# Altium schematic sheet 0016_Processor - PM , C.SchDoc
size 848 x 558 mm
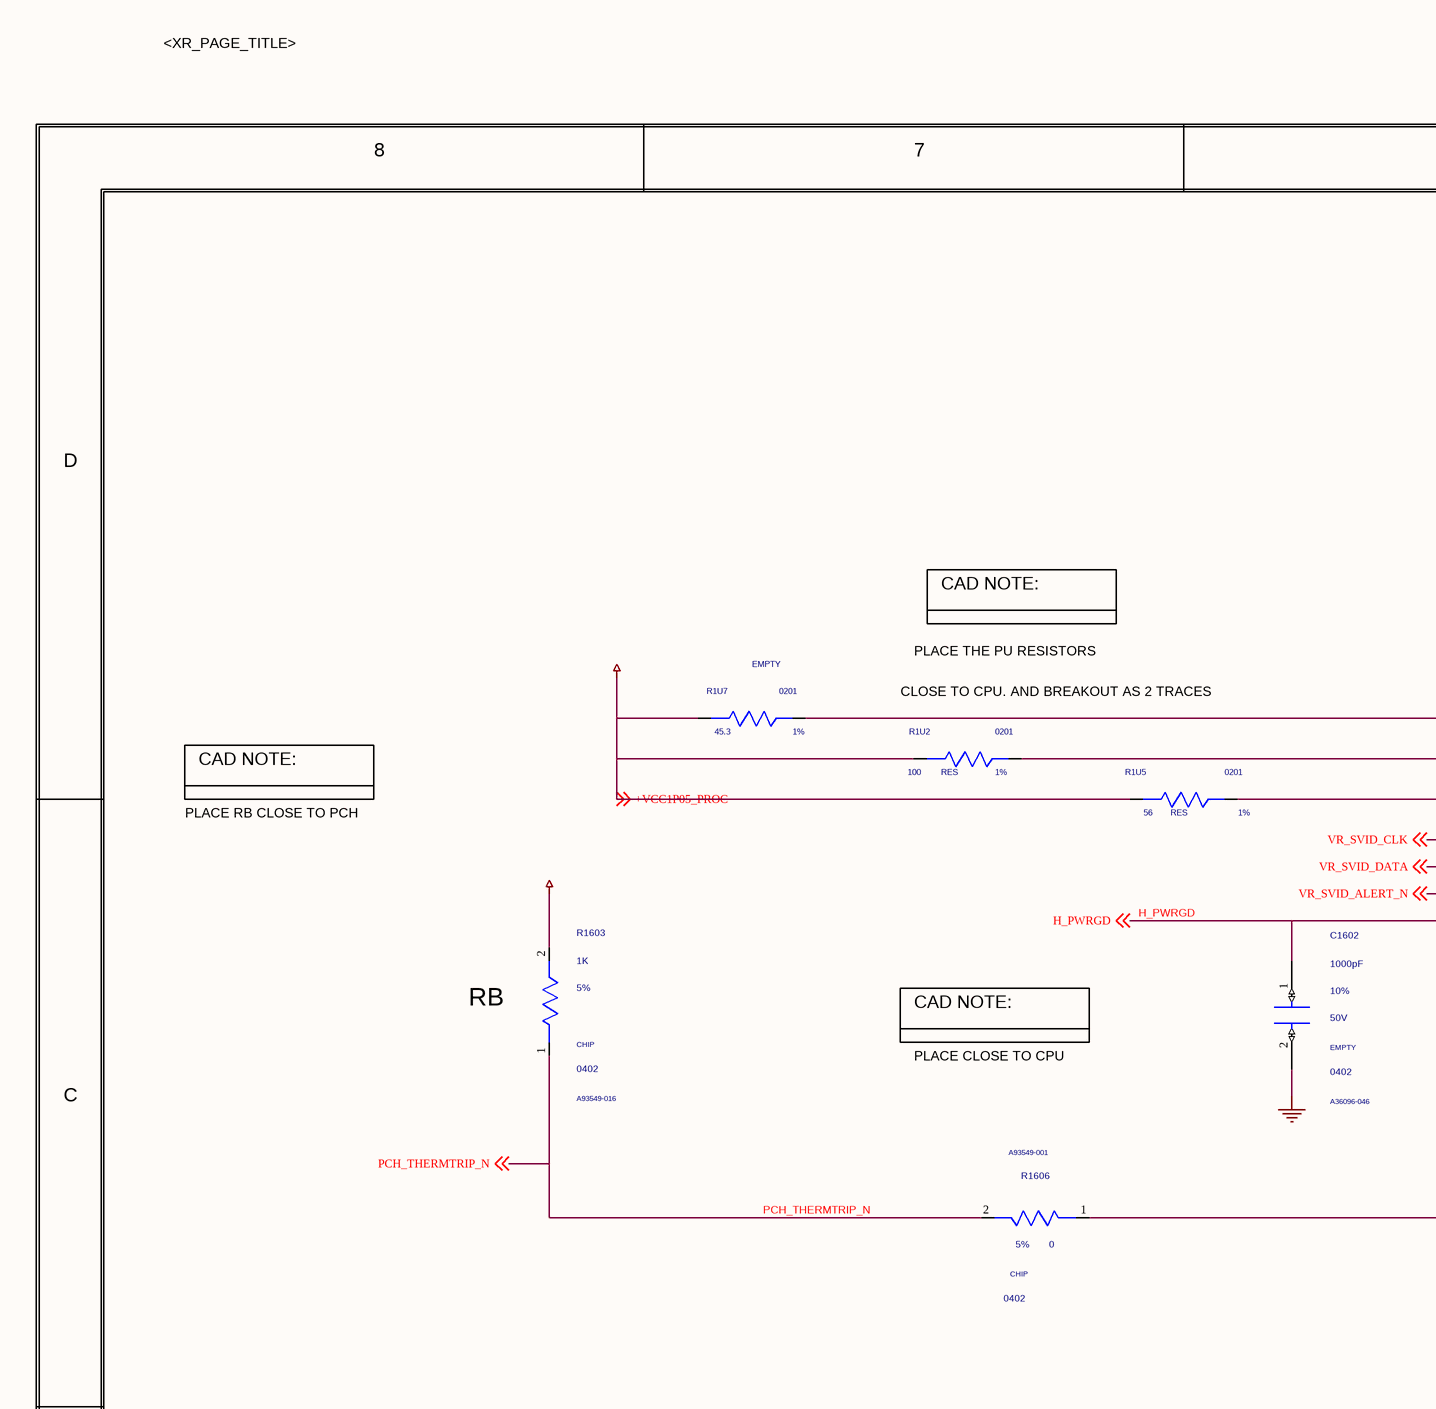
[diagram p0: 0016_Processor - PM , C.SchDoc, top left]
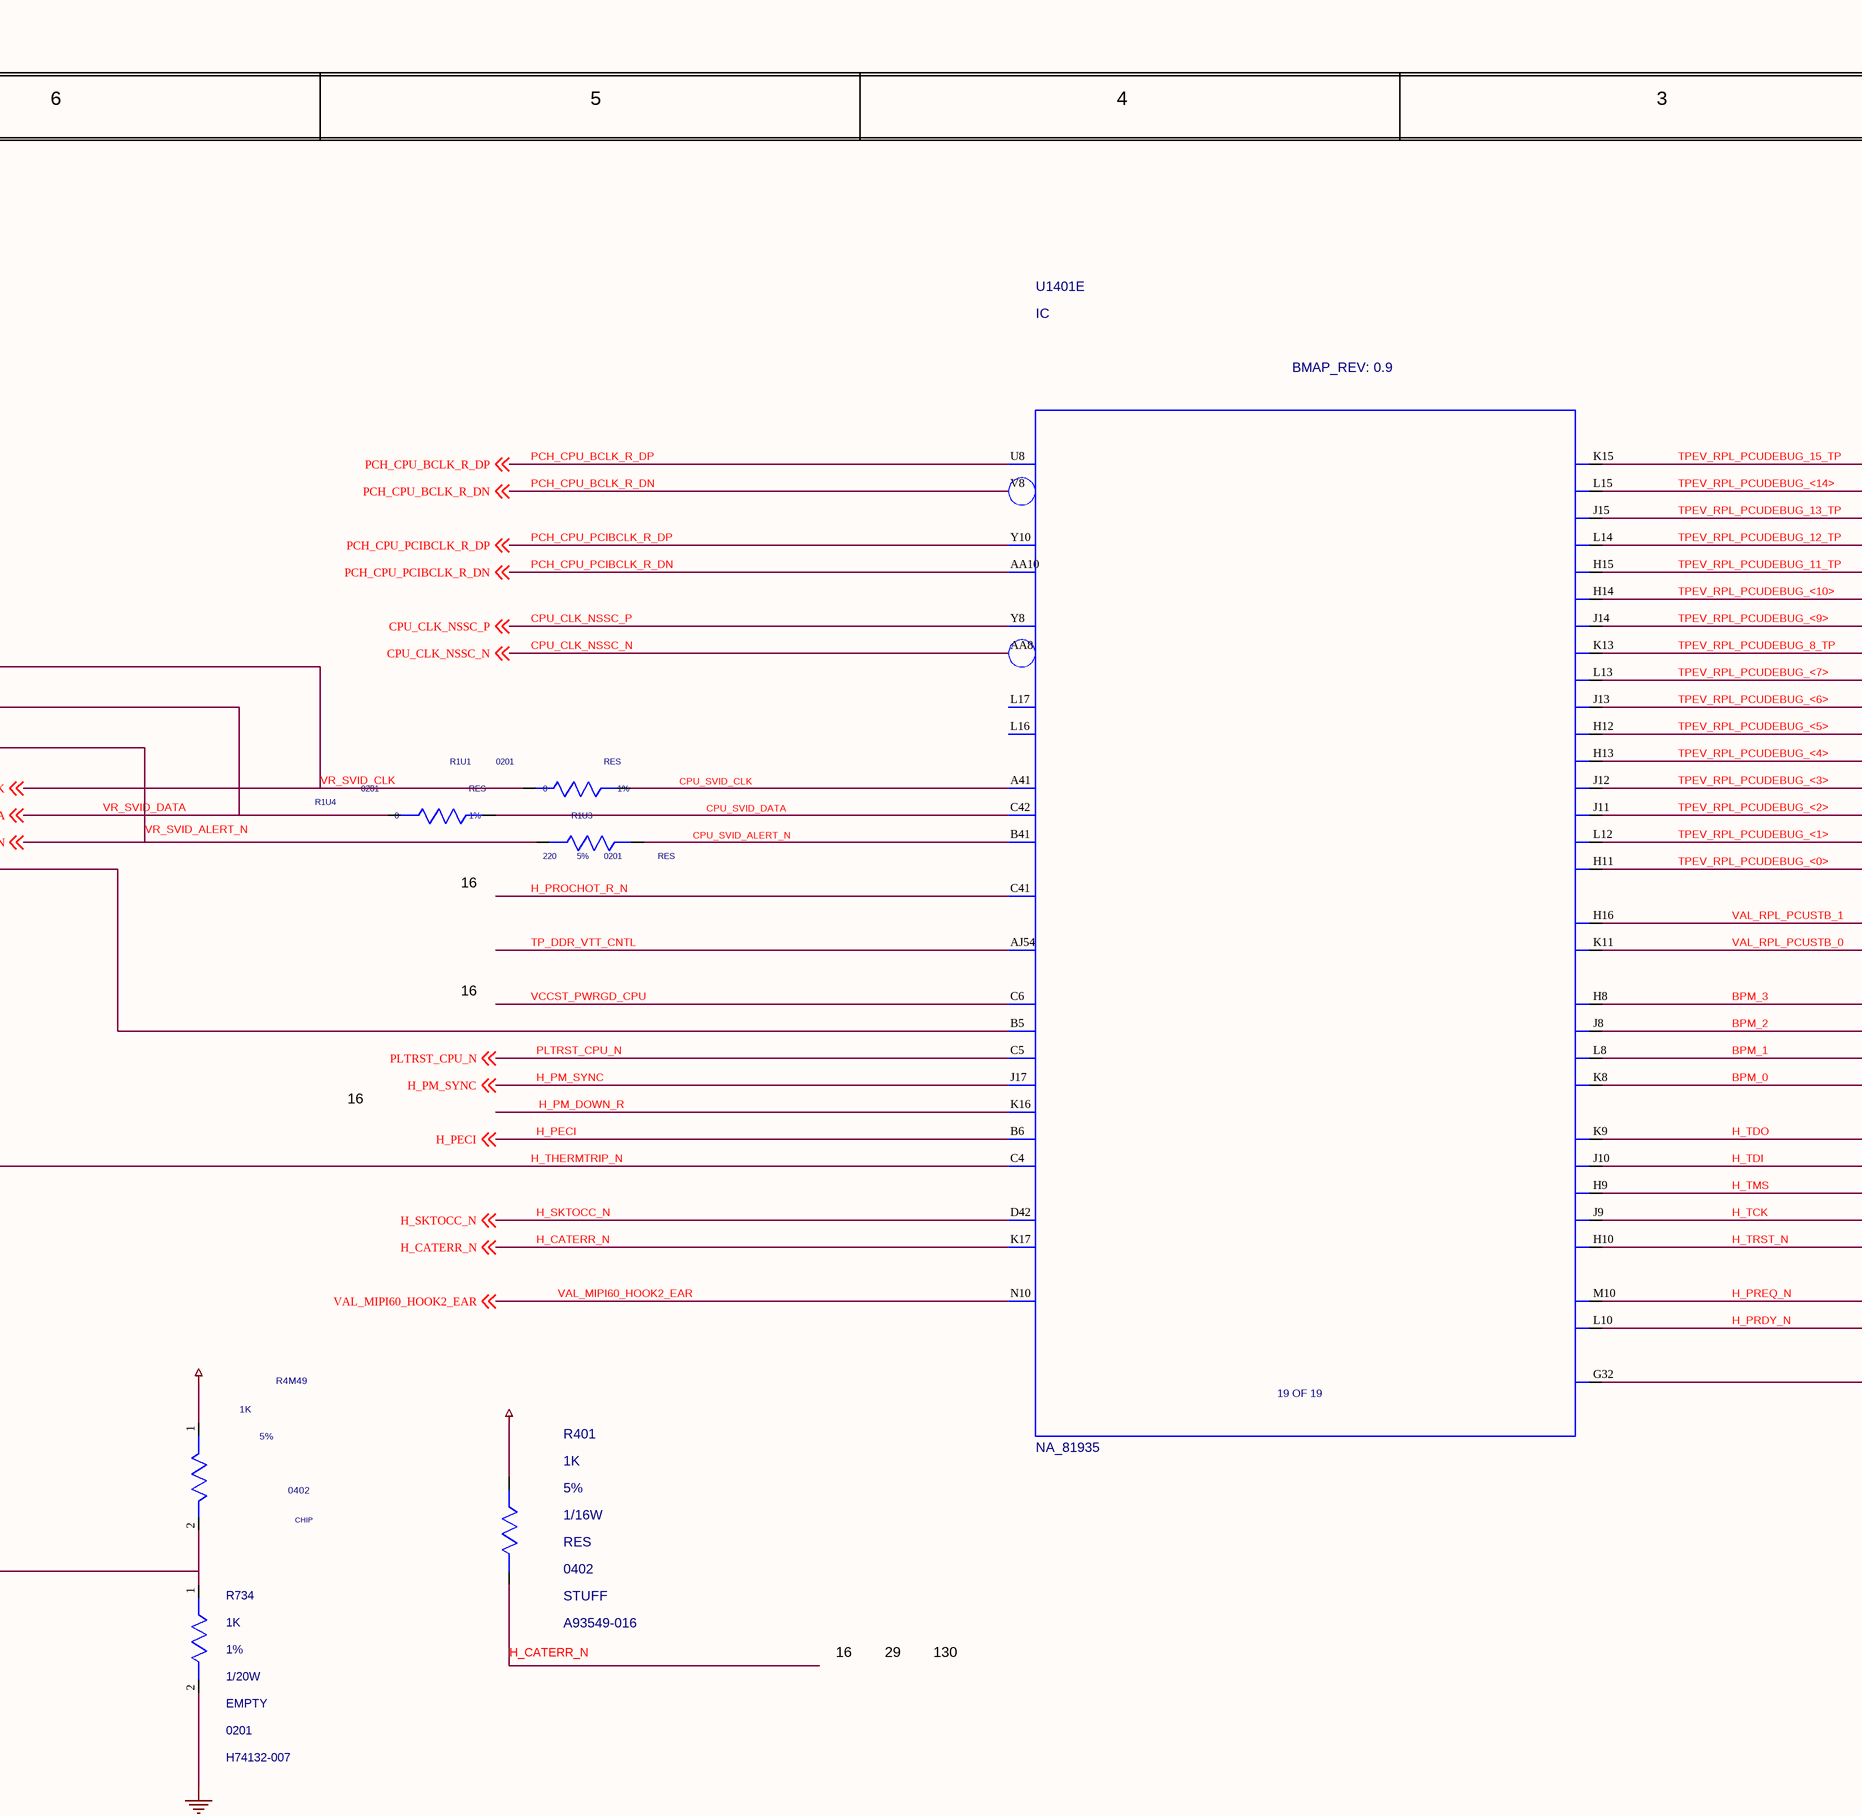
[diagram p1: 0016_Processor - PM , C.SchDoc, top middle]
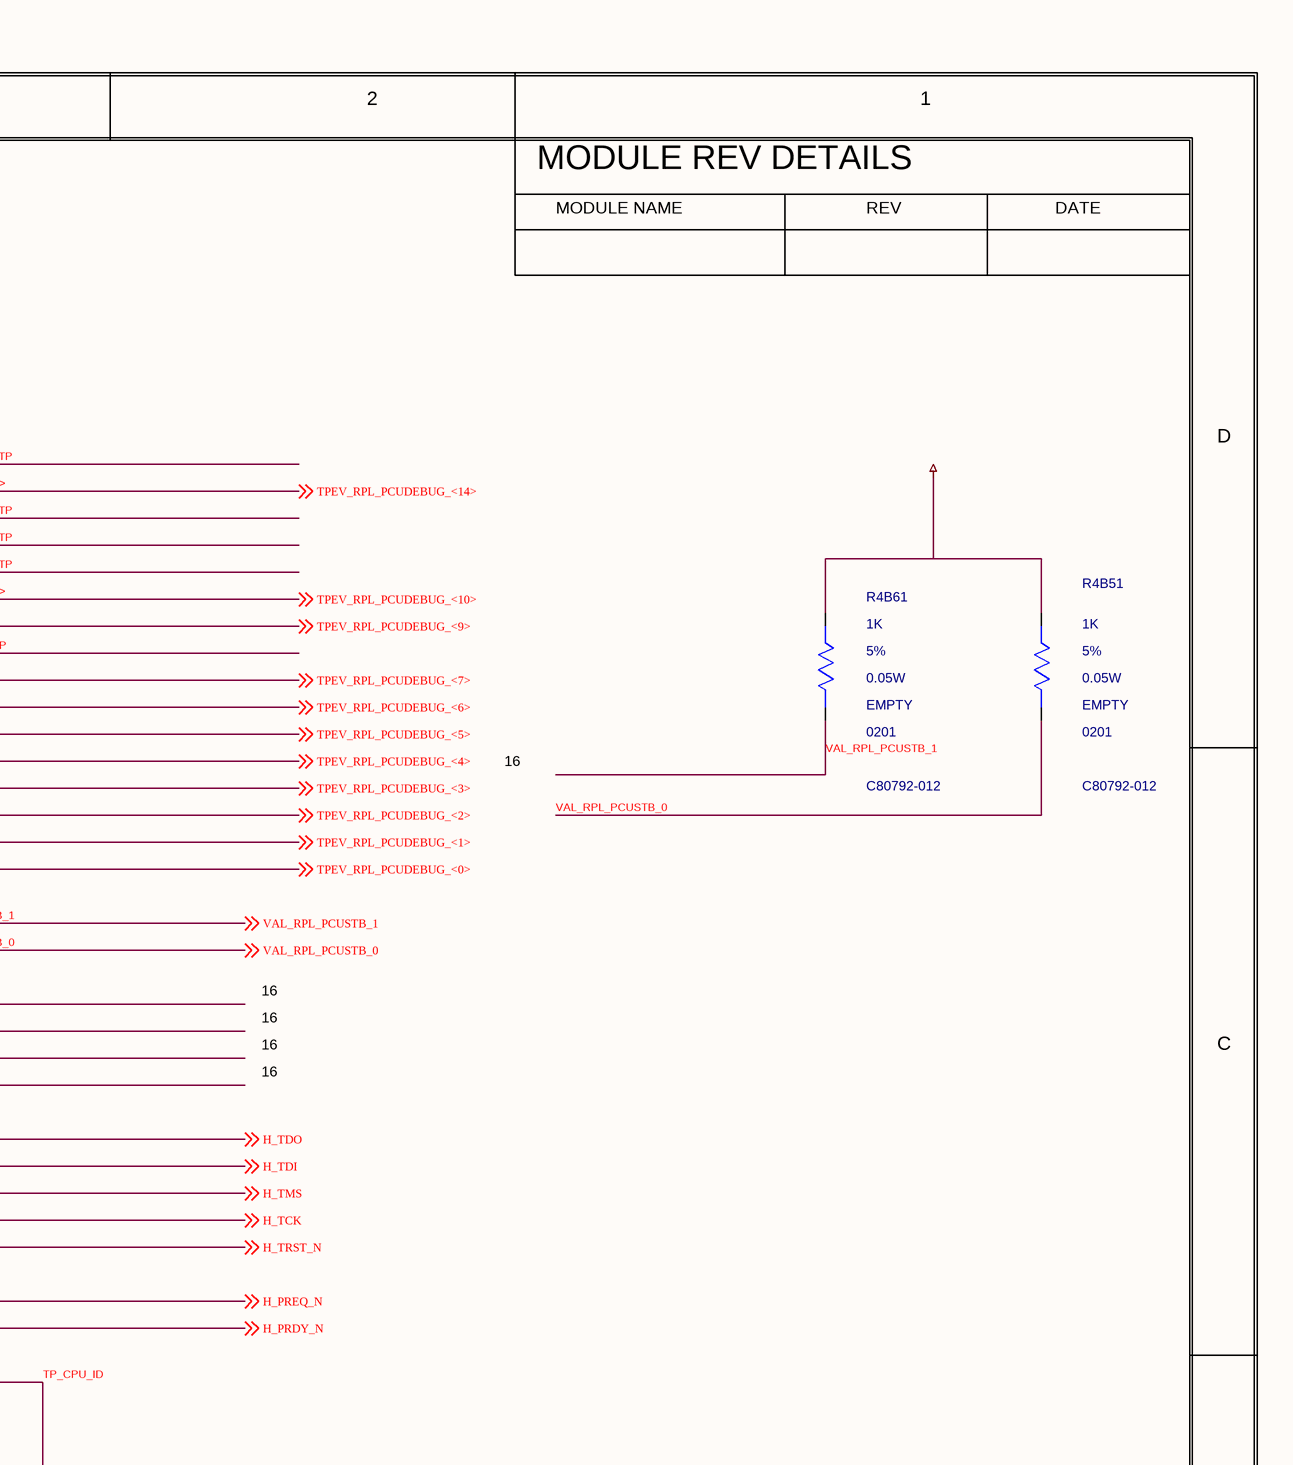
[diagram p2: 0016_Processor - PM , C.SchDoc, top right]
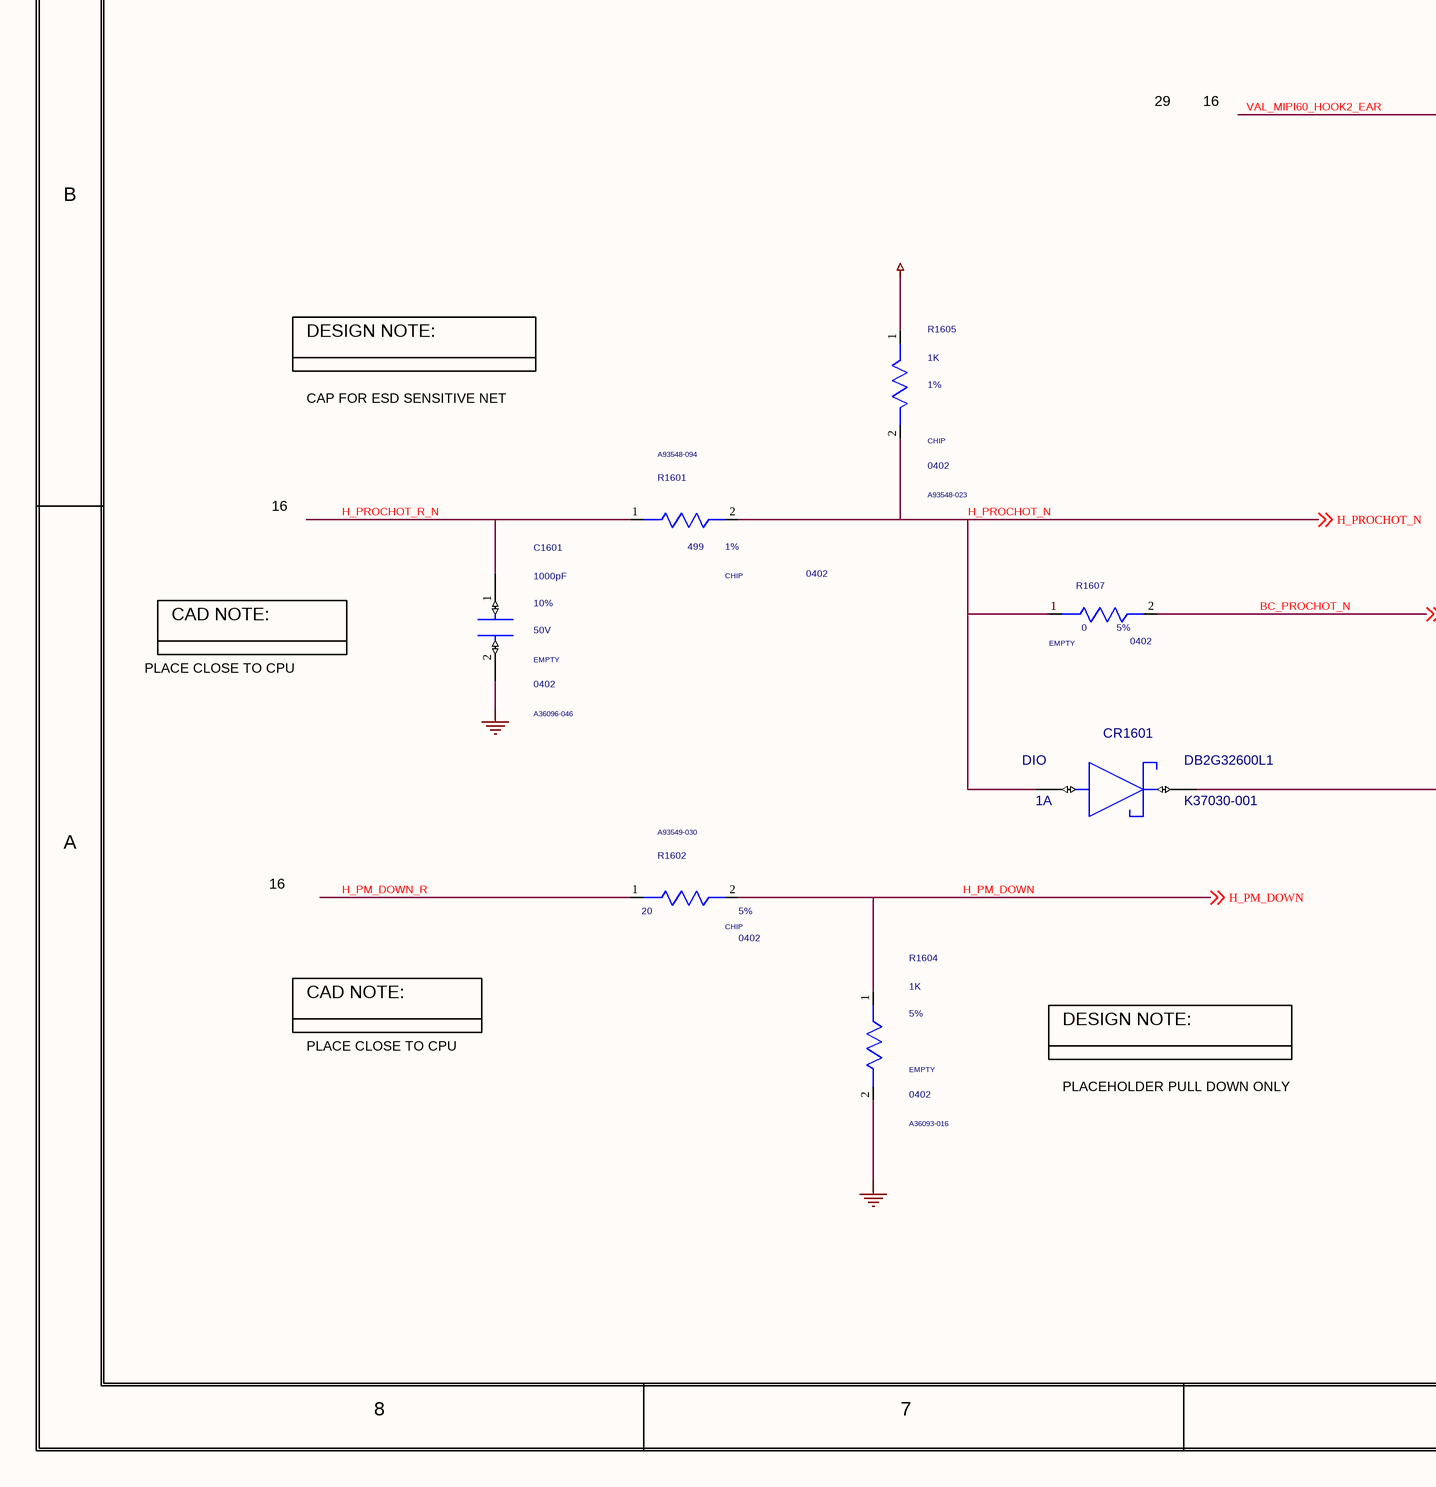
[diagram p3: 0016_Processor - PM , C.SchDoc, bottom left]
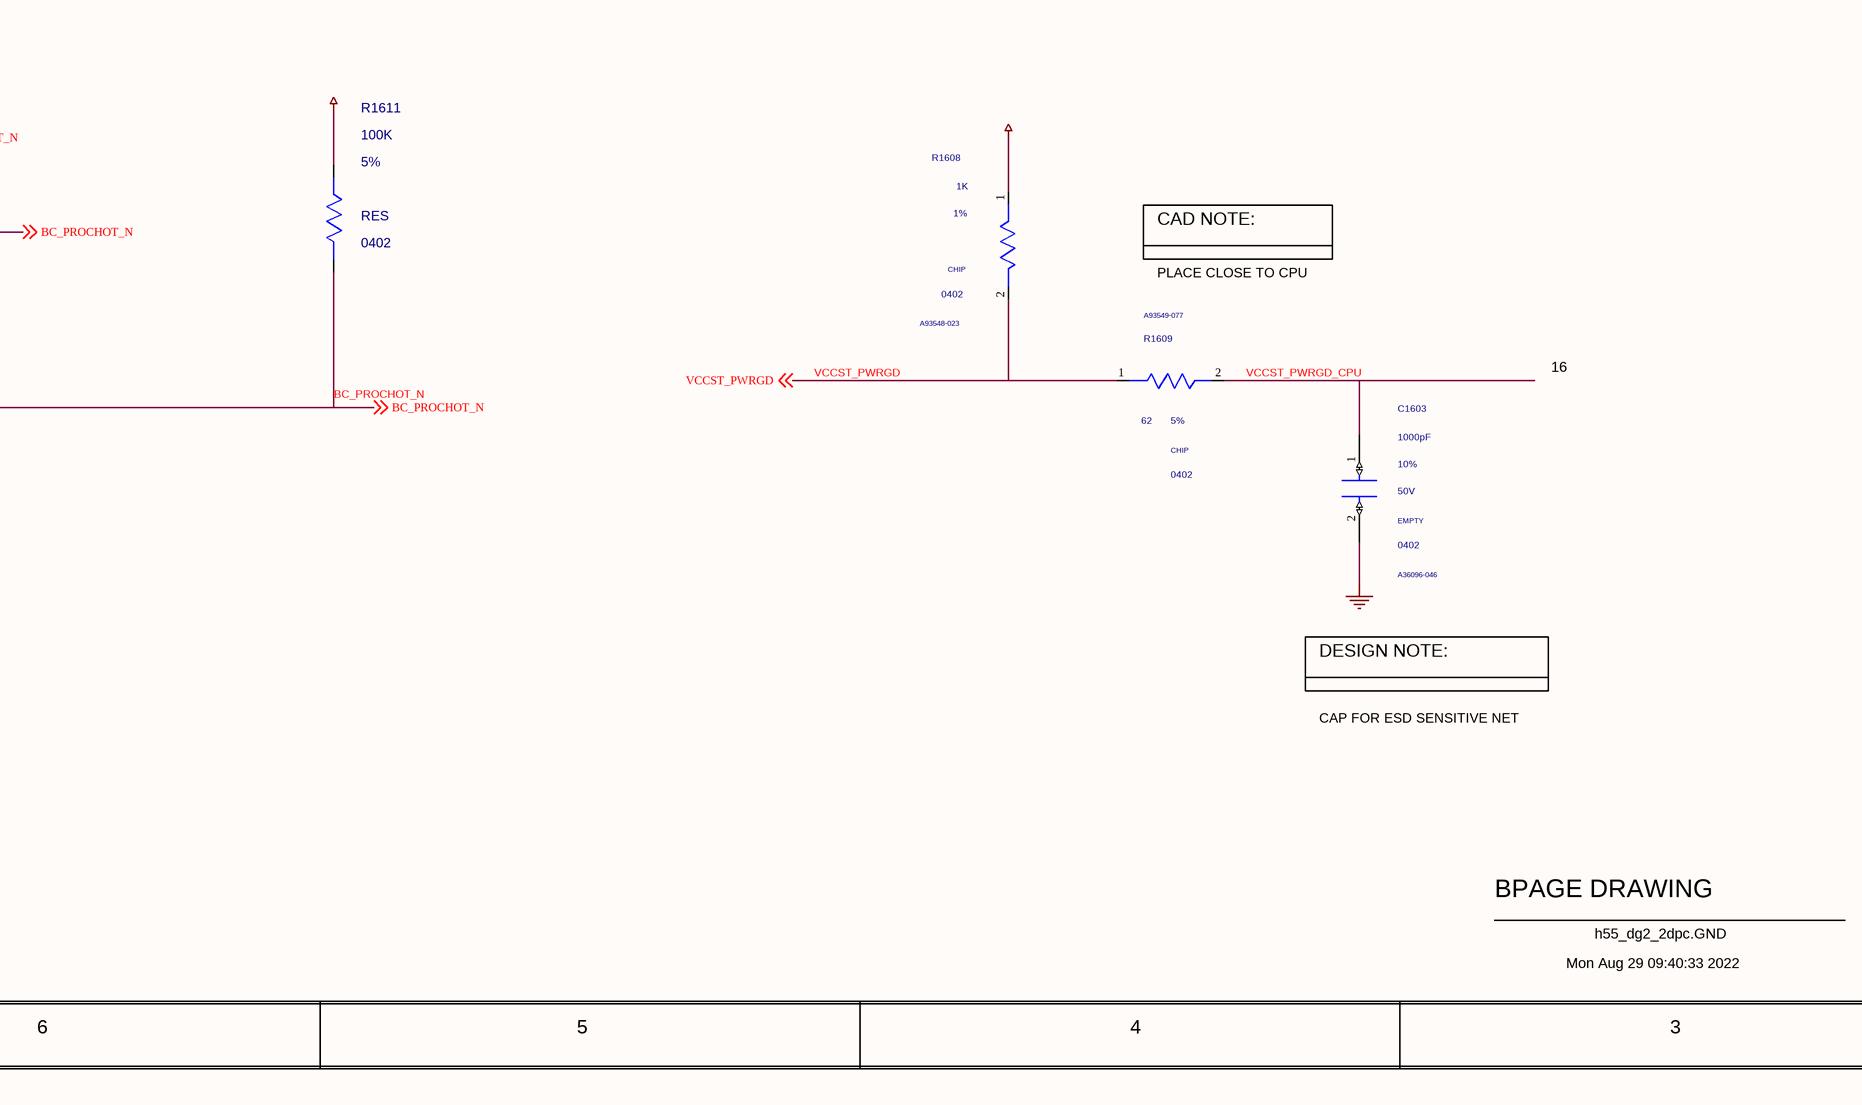
[diagram p4: 0016_Processor - PM , C.SchDoc, bottom middle]
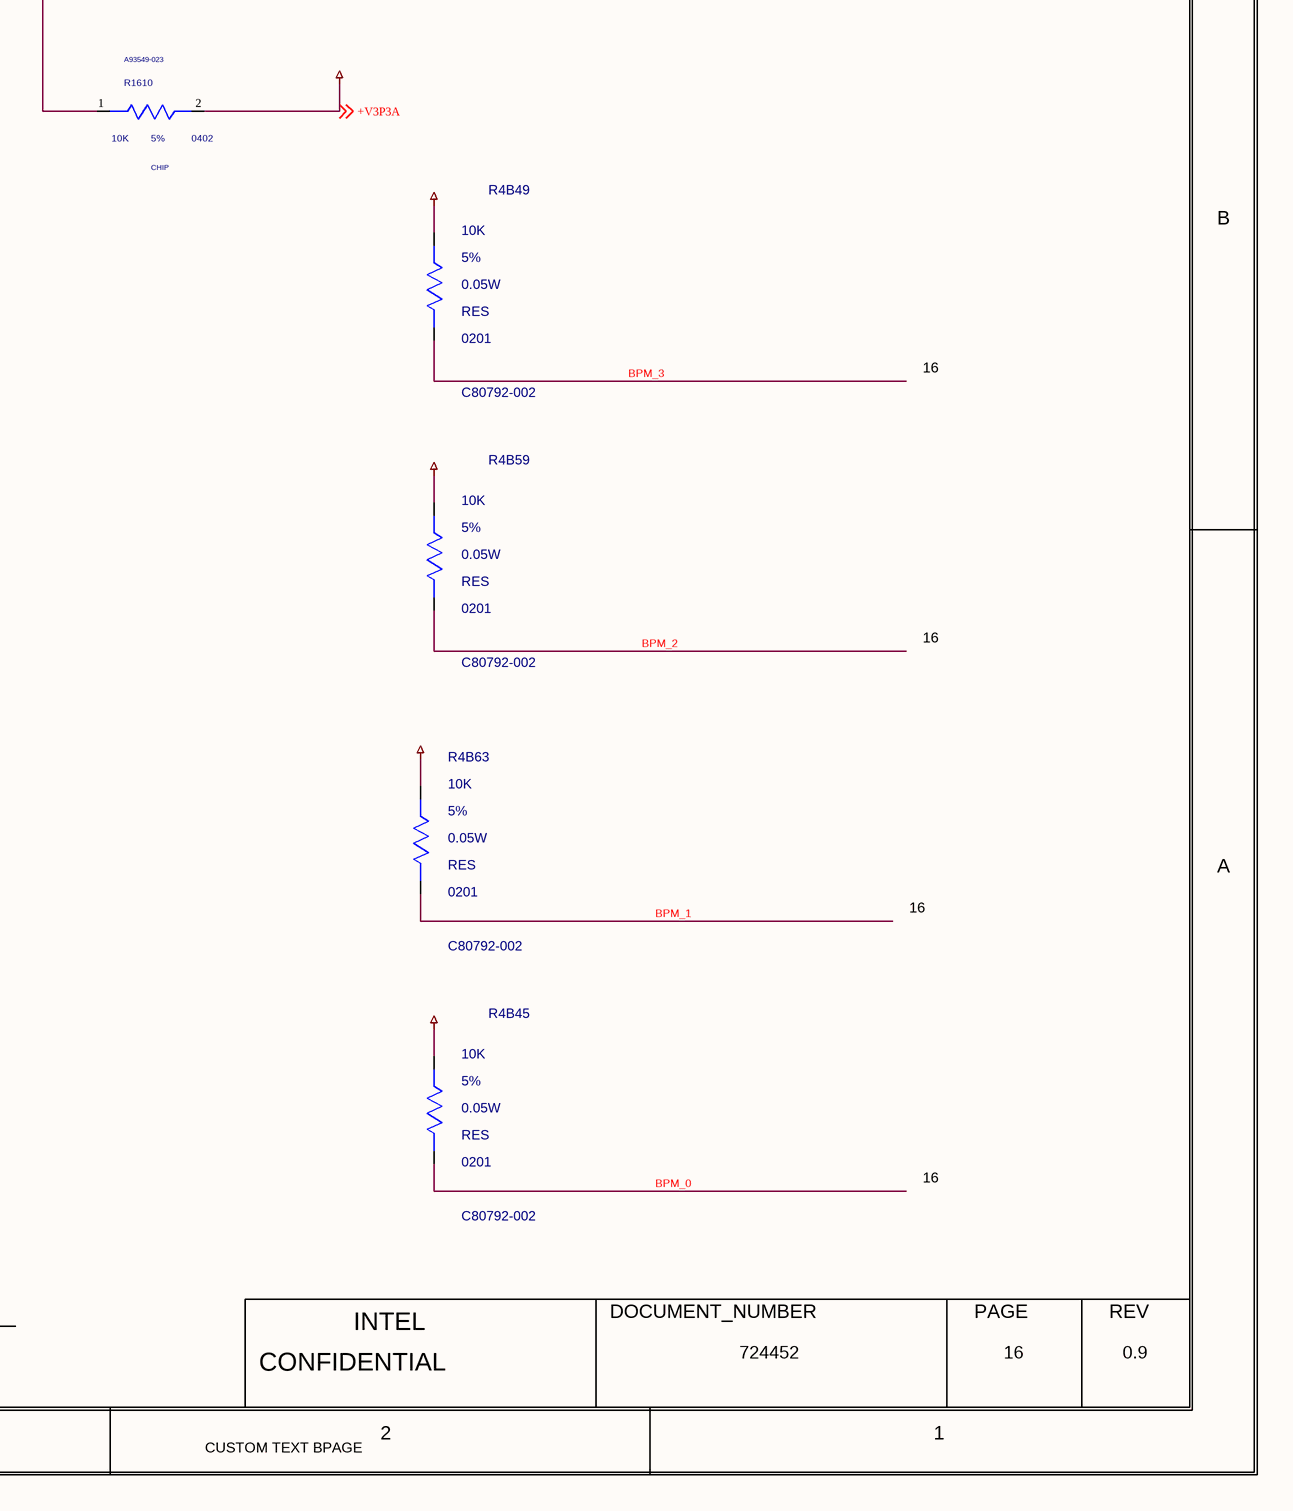
[diagram p5: 0016_Processor - PM , C.SchDoc, bottom right]

## Parts
C1601  1000pF  MATERIAL: EMPTY  PACK_TYPE: 0402  PART_NUMBER: A36096-046  TOLERANCE: 10%  VOLTAGE: 50V  [SMC0402IA]
C1602  1000pF  MATERIAL: EMPTY  PACK_TYPE: 0402  PART_NUMBER: A36096-046  TOLERANCE: 10%  VOLTAGE: 50V  [SMC0402IA]
C1603  1000pF  MATERIAL: EMPTY  PACK_TYPE: 0402  PART_NUMBER: A36096-046  TOLERANCE: 10%  VOLTAGE: 50V  [SMC0402IA]
CR1601  DB2G32600L1  CURRENT: 1A  MATERIAL: DIO  PART_NUMBER: K37030-001  [TK0_SCR0402_1050X650_MA]
R1U1  0  MATERIAL: RES  PACK_TYPE: 0201  TOLERANCE: 1%  [CTK2_SM0201_630X330_MA]
R1U2  100  MATERIAL: RES  PACK_TYPE: 0201  TOLERANCE: 1%  [CTK2_SM0201_630X330_MA]
R1U3  220  MATERIAL: RES  PACK_TYPE: 0201  TOLERANCE: 5%  [CTK2_SM0201_630X330_MA]
R1U4  0  MATERIAL: RES  PACK_TYPE: 0201  TOLERANCE: 1%  [CTK2_SM0201_630X330_MA]
R1U5  56  MATERIAL: RES  PACK_TYPE: 0201  TOLERANCE: 1%  [CTK2_SM0201_650X350_MA]
R1U7  45.3  MATERIAL: EMPTY  PACK_TYPE: 0201  TOLERANCE: 1%  [CTK2_SM0201_650X350_MA]
R4B45  10K  MATERIAL: RES  PACK_TYPE: 0201  PART_NUMBER: C80792-002  TOLERANCE: 5%  WATTAGE: 0.05W  [CTK2_SM0201_630X330_MA]
R4B49  10K  MATERIAL: RES  PACK_TYPE: 0201  PART_NUMBER: C80792-002  TOLERANCE: 5%  WATTAGE: 0.05W  [CTK2_SM0201_630X330_MA]
R4B51  1K  MATERIAL: EMPTY  PACK_TYPE: 0201  PART_NUMBER: C80792-012  TOLERANCE: 5%  WATTAGE: 0.05W  [CTK2_SM0201_630X330_MA]
R4B59  10K  MATERIAL: RES  PACK_TYPE: 0201  PART_NUMBER: C80792-002  TOLERANCE: 5%  WATTAGE: 0.05W  [CTK2_SM0201_630X330_MA]
R4B61  1K  MATERIAL: EMPTY  PACK_TYPE: 0201  PART_NUMBER: C80792-012  TOLERANCE: 5%  WATTAGE: 0.05W  [CTK2_SM0201_630X330_MA]
R4B63  10K  MATERIAL: RES  PACK_TYPE: 0201  PART_NUMBER: C80792-002  TOLERANCE: 5%  WATTAGE: 0.05W  [CTK2_SM0201_630X330_MA]
R4M49  1K  MATERIAL: CHIP  PACK_TYPE: 0402  TOLERANCE: 5%  [SMR0402IA]
R401  1K  BOM_USE: STUFF  MATERIAL: RES  PACK_TYPE: 0402  PART_NUMBER: A93549-016  TOLERANCE: 5%  WATTAGE: 1/16W  [TK0_SM0402_1100X550_MC]
R734  1K  MATERIAL: EMPTY  PACK_TYPE: 0201  PART_NUMBER: H74132-007  TOLERANCE: 1%  WATTAGE: 1/20W  [SMR0201IA]
R1601  499  MATERIAL: CHIP  PACK_TYPE: 0402  PART_NUMBER: A93548-094  TOLERANCE: 1%  [SMR0402IA]
R1602  20  MATERIAL: CHIP  PACK_TYPE: 0402  PART_NUMBER: A93549-030  TOLERANCE: 5%  [SMR0402IA]
R1603  1K  MATERIAL: CHIP  PACK_TYPE: 0402  PART_NUMBER: A93549-016  TOLERANCE: 5%  [SMR0402IA]
R1604  1K  MATERIAL: EMPTY  PACK_TYPE: 0402  PART_NUMBER: A36093-016  TOLERANCE: 5%  [SMR0402IA]
R1605  1K  MATERIAL: CHIP  PACK_TYPE: 0402  PART_NUMBER: A93548-023  TOLERANCE: 1%  [SMR0402IA]
R1606  0  MATERIAL: CHIP  PACK_TYPE: 0402  PART_NUMBER: A93549-001  TOLERANCE: 5%  [SMR0402IA]
R1607  0  MATERIAL: EMPTY  PACK_TYPE: 0402  TOLERANCE: 5%  [SMR0402IA]
R1608  1K  MATERIAL: CHIP  PACK_TYPE: 0402  PART_NUMBER: A93548-023  TOLERANCE: 1%  [SMR0402IA]
R1609  62  MATERIAL: CHIP  PACK_TYPE: 0402  PART_NUMBER: A93549-077  TOLERANCE: 5%  [SMR0402IA]
R1610  10K  MATERIAL: CHIP  PACK_TYPE: 0402  PART_NUMBER: A93549-023  TOLERANCE: 5%  [SMR0402IA]
R1611  100K  MATERIAL: RES  PACK_TYPE: 0402  TOLERANCE: 5%  [CTK2_SM0402_1100X550_MA]
U1401  BMAP_REV: 0.9  MATERIAL: IC  PART_NUMBER: NA_81935  PART_SYM_NUM: 19 OF 19  [CLPDB_BGA1964_RPL_HX_LP7530_MA]  (hidden comment: C_RPL_HX_EXT)  (part E of 19)

## Nets
+V3P3A: R1610.2(B) R1611.1(A) ; off-sheet +V3P3A
+VCC1P05_PROC: R1U2.1(A) R1U5.1(A) R1U7.1(A) R4M49.1(A) R401.1(A) R1603.2(B) R1605.1(A) R1608.1(A) ; off-sheet +VCC1P05_PROC
+VCC_CFG_PU_OUT: R4B45.1(A) R4B49.1(A) R4B51.1(A) R4B59.1(A) R4B61.1(A) R4B63.1(A)
GND: C1601.2(B) C1602.2(B) C1603.2(B) R734.2(B) R1604.2(B)
BC_PROCHOT_N: CR1601.1(CATHODE) R1607.2(B) R1611.2(B) ; off-sheet BC_PROCHOT_N
BPM_0: R4B45.2(B) U1401.K8(BPM#_0)
BPM_1: R4B63.2(B) U1401.L8(BPM#_1)
BPM_2: R4B59.2(B) U1401.J8(BPM#_2)
BPM_3: R4B49.2(B) U1401.H8(BPM#_3)
CPU_CLK_NSSC_N: U1401.AA8(CLK_NSSC_N) ; off-sheet CPU_CLK_NSSC_N
CPU_CLK_NSSC_P: U1401.Y8(CLK_NSSC_P) ; off-sheet CPU_CLK_NSSC_P
CPU_SVID_ALERT_N: R1U3.2(B) U1401.B41(VIDALERT#)
CPU_SVID_CLK: R1U1.2(B) U1401.A41(VIDSCK)
CPU_SVID_DATA: R1U4.2(B) U1401.C42(VIDSOUT)
H_CATERR_N: R401.2(B) U1401.K17(CATERR#) ; off-sheet H_CATERR_N
H_PECI: U1401.B6(PECI) ; off-sheet H_PECI
H_PM_DOWN: R1602.2(B) R1604.1(A) ; off-sheet H_PM_DOWN
H_PM_DOWN_R: R1602.1(A) U1401.K16(PM_DOWN)
H_PM_SYNC: U1401.J17(PM_SYNC) ; off-sheet H_PM_SYNC
H_PRDY_N: U1401.L10(PROC_PRDY#) ; off-sheet H_PRDY_N
H_PREQ_N: U1401.M10(PROC_PREQ#) ; off-sheet H_PREQ_N
H_PROCHOT_N: CR1601.2(ANODE) R1601.2(B) R1605.2(B) R1607.1(A) ; off-sheet H_PROCHOT_N
H_PROCHOT_R_N: C1601.1(A) R1601.1(A) U1401.C41(PROCHOT#)
H_PWRGD: C1602.1(A) U1401.B5(PROCPWRGD) ; off-sheet H_PWRGD
H_SKTOCC_N: U1401.D42(SKTOCC#) ; off-sheet H_SKTOCC_N
H_TCK: U1401.J9(PROC_TCK) ; off-sheet H_TCK
H_TDI: U1401.J10(PROC_TDI) ; off-sheet H_TDI
H_TDO: U1401.K9(PROC_TDO) ; off-sheet H_TDO
H_THERMTRIP_N: R1606.1(A) U1401.C4(THERMTRIP#)
H_TMS: U1401.H9(PROC_TMS) ; off-sheet H_TMS
H_TRST_N: U1401.H10(PROC_JTAG_TRST#) ; off-sheet H_TRST_N
PCH_CPU_BCLK_R_DN: U1401.V8(BCLK_N) ; off-sheet PCH_CPU_BCLK_R_DN
PCH_CPU_BCLK_R_DP: U1401.U8(BCLK_P) ; off-sheet PCH_CPU_BCLK_R_DP
PCH_CPU_PCIBCLK_R_DN: U1401.AA10(PCI_BCLKN) ; off-sheet PCH_CPU_PCIBCLK_R_DN
PCH_CPU_PCIBCLK_R_DP: U1401.Y10(PCI_BCLKP) ; off-sheet PCH_CPU_PCIBCLK_R_DP
PCH_THERMTRIP_N: R1603.1(A) R1606.2(B) ; off-sheet PCH_THERMTRIP_N
PLTRST_CPU_N: U1401.C5(RESET#) ; off-sheet PLTRST_CPU_N
TP_CPU_ID: R1610.1(A) U1401.G32(CPU_ID)
TP_DDR_VTT_CNTL: U1401.AJ54(DDR_VTT_CTL)
TPEV_RPL_PCUDEBUG_8_TP: U1401.K13(CFG_8)
TPEV_RPL_PCUDEBUG_11_TP: U1401.H15(CFG_11)
TPEV_RPL_PCUDEBUG_12_TP: U1401.L14(CFG_12)
TPEV_RPL_PCUDEBUG_13_TP: U1401.J15(CFG_13)
TPEV_RPL_PCUDEBUG_15_TP: U1401.K15(CFG_15)
TPEV_RPL_PCUDEBUG_<0>: U1401.H11(CFG_0) ; off-sheet TPEV_RPL_PCUDEBUG_<0>
TPEV_RPL_PCUDEBUG_<1>: U1401.L12(CFG_1) ; off-sheet TPEV_RPL_PCUDEBUG_<1>
TPEV_RPL_PCUDEBUG_<2>: U1401.J11(CFG_2) ; off-sheet TPEV_RPL_PCUDEBUG_<2>
TPEV_RPL_PCUDEBUG_<3>: U1401.J12(CFG_3) ; off-sheet TPEV_RPL_PCUDEBUG_<3>
TPEV_RPL_PCUDEBUG_<4>: U1401.H13(CFG_4) ; off-sheet TPEV_RPL_PCUDEBUG_<4>
TPEV_RPL_PCUDEBUG_<5>: U1401.H12(CFG_5) ; off-sheet TPEV_RPL_PCUDEBUG_<5>
TPEV_RPL_PCUDEBUG_<6>: U1401.J13(CFG_6) ; off-sheet TPEV_RPL_PCUDEBUG_<6>
TPEV_RPL_PCUDEBUG_<7>: U1401.L13(CFG_7) ; off-sheet TPEV_RPL_PCUDEBUG_<7>
TPEV_RPL_PCUDEBUG_<9>: U1401.J14(CFG_9) ; off-sheet TPEV_RPL_PCUDEBUG_<9>
TPEV_RPL_PCUDEBUG_<10>: U1401.H14(CFG_10) ; off-sheet TPEV_RPL_PCUDEBUG_<10>
TPEV_RPL_PCUDEBUG_<14>: U1401.L15(CFG_14) ; off-sheet TPEV_RPL_PCUDEBUG_<14>
VAL_MIPI60_HOOK2_EAR: R4M49.2(B) R734.1(A) U1401.N10(EAR#) ; off-sheet VAL_MIPI60_HOOK2_EAR
VAL_RPL_PCUSTB_0: R4B51.2(B) U1401.K11(CFG_16) ; off-sheet VAL_RPL_PCUSTB_0
VAL_RPL_PCUSTB_1: R4B61.2(B) U1401.H16(CFG_17) ; off-sheet VAL_RPL_PCUSTB_1
VCCST_PWRGD: R1608.2(B) R1609.1(A) ; off-sheet VCCST_PWRGD
VCCST_PWRGD_CPU: C1603.1(A) R1609.2(B) U1401.C6(VCCST_PWRGD)
VR_SVID_ALERT_N: R1U3.1(A) R1U5.2(B) ; off-sheet VR_SVID_ALERT_N
VR_SVID_CLK: R1U1.1(A) R1U7.2(B) ; off-sheet VR_SVID_CLK
VR_SVID_DATA: R1U2.2(B) R1U4.1(A) ; off-sheet VR_SVID_DATA

Not connected (* = marked no-connect by the designer): U1401 L16(RSVD_42) L17(RSVD_43)

## Notes on the sheet
- <XR_PAGE_TITLE>
- 8
- 7
- 6
- 5
- 4
- 3
- 2
- 1
- MODULE REV DETAILS
- MODULE NAME
- REV
- DATE
- D
- CAD NOTE:
- PLACE THE PU RESISTORS
- CLOSE TO CPU. AND BREAKOUT AS 2 TRACES
- PLACE RB CLOSE TO PCH
- 16
- RB
- PLACE CLOSE TO CPU
- C
- 29
- B
- 130
- DESIGN NOTE:
- CAP FOR ESD SENSITIVE NET
- A
- PLACEHOLDER PULL DOWN ONLY
- BPAGE DRAWING
- INTEL
- DOCUMENT_NUMBER
- PAGE
- Mon Aug 29 09:40:33 2022
- h55_dg2_2dpc.GND
- CONFIDENTIAL
- 724452
- 0.9
- CUSTOM TEXT BPAGE

## Library data of the parts
C1601 = CAP: CDS_PHYS_PART_NAME: CAP_0402-A36096-046,EMPTY,1000PF,50V,10%,LPDB,GENERIC; OriginalSymbolOrigin: (-50,25); XY: (-7350,1400); VER: 1; ROT: 0; PHYS_PAGE: 16; LOCATION: C1601; IP: GENERIC; FP_TECH: LPDB; DRAWING: @RVP1_ADL_SB_ADP_S_DDR5_SODIMM_2DPC_LIB.H55_DG2_2DPC(SCH_1):PAGE16; CDS_LIB: discrete; PCB Footprint: SMC0402IA; SEC_TYPE: 0402; CHIPS_PART_NAME: CAP; CDS_PART_NAME: CAP_0402-A36096-046,EMPTY,1000PF,50V,10%,LPDB,GENERIC; CDS_LOCATION: C1601; ASI_MODEL: A36096-046
C1602 = CAP: CDS_PHYS_PART_NAME: CAP_0402-A36096-046,EMPTY,1000PF,50V,10%,LPDB,GENERIC; OriginalSymbolOrigin: (-50,25); XY: (-5875,3475); VER: 1; ROT: 0; PHYS_PAGE: 16; LOCATION: C1602; IP: GENERIC; FP_TECH: LPDB; DRAWING: @RVP1_ADL_SB_ADP_S_DDR5_SODIMM_2DPC_LIB.H55_DG2_2DPC(SCH_1):PAGE16; CDS_LIB: discrete; PCB Footprint: SMC0402IA; SEC_TYPE: 0402; CHIPS_PART_NAME: CAP; CDS_PART_NAME: CAP_0402-A36096-046,EMPTY,1000PF,50V,10%,LPDB,GENERIC; CDS_LOCATION: C1602; ASI_MODEL: A36096-046
C1603 = CAP: CDS_PHYS_PART_NAME: CAP_0402-A36096-046,EMPTY,1000PF,50V,10%,LPDB,GENERIC; OriginalSymbolOrigin: (-50,25); XY: (-3150,950); VER: 1; ROT: 0; PHYS_PAGE: 16; LOCATION: C1603; IP: GENERIC; FP_TECH: LPDB; DRAWING: @RVP1_ADL_SB_ADP_S_DDR5_SODIMM_2DPC_LIB.H55_DG2_2DPC(SCH_1):PAGE16; CDS_LIB: discrete; PCB Footprint: SMC0402IA; SEC_TYPE: 0402; CHIPS_PART_NAME: CAP; CDS_PART_NAME: CAP_0402-A36096-046,EMPTY,1000PF,50V,10%,LPDB,GENERIC; CDS_LOCATION: C1603; ASI_MODEL: A36096-046
CR1601 = DIODE_SCHOTTKY_2: CDS_PHYS_PART_NAME: DIODE_SCHOTTKY_2_SM-K37030-001,DIO,DB2G32600L1,1A,TK0,GENERIC; BOM_USE: STUFF; CDS_LMAN_SYM_OUTLINE: -50,100,50,-100; FP_TECH: TK0; IP: GENERIC; PACK_TYPE: SM; ROOM: NONE; OriginalSymbolOrigin: (-75,50); XY: (-6200,1100); VER: 1; ROT: 0; PHYS_PAGE: 16; LOCATION: CR1601; DRAWING: @RVP1_ADL_SB_ADP_S_DDR5_SODIMM_2DPC_LIB.H55_DG2_2DPC(SCH_1):PAGE16; CDS_LIB: local; VARIANT: ?; PCB Footprint: TK0_SCR0402_1050X650_MA; CHIPS_PART_NAME: DIODE_SCHOTTKY_2; CDS_PART_NAME: DIODE_SCHOTTKY_2_SM-K37030-001,DIO,DB2G32600L1,1A,TK0,GENERIC; CDS_LOCATION: CR1601
R1U1 = C_RES#1: PART_NUMBER: C48657-027; CHIPS_PART_NAME: C_RES; CDS_PHYS_PART_NAME: C_RES_0201-C48657-027,RES,0,1%,0.05W,TK2,GENERIC; CDS_LMAN_SYM_OUTLINE: -50,50,50,-50; FP_TECH: TK2; IP: GENERIC; ROOM: NONE; WATTAGE: 0.05W; OriginalSymbolOrigin: (-75,25); XY: (-4600,3800); VER: 1; PHYS_PAGE: 16; LOCATION: R1U1; DRAWING: @RVP1_ADL_SB_ADP_S_DDR5_SODIMM_2DPC_LIB.H55_DG2_2DPC(SCH_1):PAGE16; CDS_LIB: c_discrete; VARIANT: ?; PCB Footprint: CTK2_SM0201_630X330_MA; ROT: 0; CDS_PART_NAME: C_RES_0201-C48657-027,RES,0,1%,0.05W,TK2,GENERIC; CDS_LOCATION: R1U1
R1U2 = C_RES#1: PART_NUMBER: D93252-001; CHIPS_PART_NAME: C_RES; CDS_PHYS_PART_NAME: C_RES_0201-D93252-001,RES,100,1%,0.05W,TK2,GENERIC; CDS_LMAN_SYM_OUTLINE: -50,50,50,-50; FP_TECH: TK2; IP: GENERIC; ROOM: NONE; WATTAGE: 0.05W; OriginalSymbolOrigin: (-75,25); XY: (-6475,3950); VER: 1; ROT: 0; PHYS_PAGE: 16; LOCATION: R1U2; DRAWING: @RVP1_ADL_SB_ADP_S_DDR5_SODIMM_2DPC_LIB.H55_DG2_2DPC(SCH_1):PAGE16; CDS_LIB: c_discrete; VARIANT: ?; PCB Footprint: CTK2_SM0201_630X330_MA; CDS_PART_NAME: C_RES_0201-D93252-001,RES,100,1%,0.05W,TK2,GENERIC; CDS_LOCATION: R1U2
R1U3 = C_RES#1: PART_NUMBER: H30143-016; CHIPS_PART_NAME: C_RES; CDS_PHYS_PART_NAME: C_RES_0201-H30143-016,RES,220,5%,0.05W,TK2,GENERIC; CDS_LMAN_SYM_OUTLINE: -50,50,50,-50; FP_TECH: TK2; IP: GENERIC; ROOM: NONE; WATTAGE: 0.05W; OriginalSymbolOrigin: (-75,25); XY: (-4575,3700); VER: 1; ROT: 0; PHYS_PAGE: 16; LOCATION: R1U3; DRAWING: @RVP1_ADL_SB_ADP_S_DDR5_SODIMM_2DPC_LIB.H55_DG2_2DPC(SCH_1):PAGE16; CDS_LIB: c_discrete; VARIANT: ?; PCB Footprint: CTK2_SM0201_630X330_MA; CDS_PART_NAME: C_RES_0201-H30143-016,RES,220,5%,0.05W,TK2,GENERIC; CDS_LOCATION: R1U3
R1U4 = C_RES#1: PART_NUMBER: C48657-027; CHIPS_PART_NAME: C_RES; CDS_PHYS_PART_NAME: C_RES_0201-C48657-027,RES,0,1%,0.05W,TK2,GENERIC; CDS_LMAN_SYM_OUTLINE: -50,50,50,-50; FP_TECH: TK2; IP: GENERIC; ROOM: NONE; WATTAGE: 0.05W; OriginalSymbolOrigin: (-75,25); XY: (-4850,3750); VER: 1; PHYS_PAGE: 16; LOCATION: R1U4; DRAWING: @RVP1_ADL_SB_ADP_S_DDR5_SODIMM_2DPC_LIB.H55_DG2_2DPC(SCH_1):PAGE16; CDS_LIB: c_discrete; VARIANT: ?; PCB Footprint: CTK2_SM0201_630X330_MA; ROT: 0; CDS_PART_NAME: C_RES_0201-C48657-027,RES,0,1%,0.05W,TK2,GENERIC; CDS_LOCATION: R1U4
R1U5 = C_RES#1: PART_NUMBER: K52093-001; CHIPS_PART_NAME: C_RES; CDS_PHYS_PART_NAME: C_RES_0201-K52093-001,RES,56,1%,0.05W,TK2,GENERIC; CDS_LMAN_SYM_OUTLINE: -50,50,50,-50; FP_TECH: TK2; IP: GENERIC; ROOM: NONE; WATTAGE: 0.05W; OriginalSymbolOrigin: (-75,25); XY: (-6075,3875); VER: 1; ROT: 0; PHYS_PAGE: 16; LOCATION: R1U5; DRAWING: @RVP1_ADL_SB_ADP_S_DDR5_SODIMM_2DPC_LIB.H55_DG2_2DPC(SCH_1):PAGE16; CDS_LIB: c_discrete; VARIANT: ?; PCB Footprint: CTK2_SM0201_650X350_MA; CDS_PART_NAME: C_RES_0201-K52093-001,RES,56,1%,0.05W,TK2,GENERIC; CDS_LOCATION: R1U5
R1U7 = C_RES#1: PART_NUMBER: C48657-209; CHIPS_PART_NAME: C_RES; CDS_PHYS_PART_NAME: C_RES_0201-C48657-209,EMPTY,45.3,1%,0.05W,TK2,GENERIC; CDS_LMAN_SYM_OUTLINE: -50,50,50,-50; FP_TECH: TK2; IP: GENERIC; ROOM: NONE; WATTAGE: 0.05W; OriginalSymbolOrigin: (-75,25); XY: (-6875,4025); VER: 1; ROT: 0; PHYS_PAGE: 16; LOCATION: R1U7; DRAWING: @RVP1_ADL_SB_ADP_S_DDR5_SODIMM_2DPC_LIB.H55_DG2_2DPC(SCH_1):PAGE16; CDS_LIB: c_discrete; VARIANT: ?; PCB Footprint: CTK2_SM0201_650X350_MA; CDS_PART_NAME: C_RES_0201-C48657-209,EMPTY,45.3,1%,0.05W,TK2,GENERIC; CDS_LOCATION: R1U7
R4B45 = C_RES: CDS_PHYS_PART_NAME: C_RES_0201-C80792-002,RES,10K,5%,0.05W,TK2,GENERIC; CDS_LMAN_SYM_OUTLINE: -50,50,50,-50; FP_TECH: TK2; IP: GENERIC; ROOM: NONE; OriginalSymbolOrigin: (-25,75); XY: (-1475,550); VER: 2; ROT: 0; PHYS_PAGE: 16; LOCATION: R4B45; DRAWING: @RVP1_ADL_SB_ADP_S_DDR5_SODIMM_2DPC_LIB.H55_DG2_2DPC(SCH_1):PAGE16; CDS_LIB: c_discrete; VARIANT: ?; PCB Footprint: CTK2_SM0201_630X330_MA; CHIPS_PART_NAME: C_RES; CDS_PART_NAME: C_RES_0201-C80792-002,RES,10K,5%,0.05W,TK2,GENERIC; CDS_LOCATION: R4B45
R4B49 = C_RES: CDS_PHYS_PART_NAME: C_RES_0201-C80792-002,RES,10K,5%,0.05W,TK2,GENERIC; CDS_LMAN_SYM_OUTLINE: -50,50,50,-50; FP_TECH: TK2; IP: GENERIC; ROOM: NONE; OriginalSymbolOrigin: (-25,75); XY: (-1475,2075); VER: 2; ROT: 0; PHYS_PAGE: 16; LOCATION: R4B49; DRAWING: @RVP1_ADL_SB_ADP_S_DDR5_SODIMM_2DPC_LIB.H55_DG2_2DPC(SCH_1):PAGE16; CDS_LIB: c_discrete; VARIANT: ?; PCB Footprint: CTK2_SM0201_630X330_MA; CHIPS_PART_NAME: C_RES; CDS_PART_NAME: C_RES_0201-C80792-002,RES,10K,5%,0.05W,TK2,GENERIC; CDS_LOCATION: R4B49
R4B51 = C_RES: CDS_PHYS_PART_NAME: C_RES_0201-C80792-012,EMPTY,1K,5%,0.05W,TK2,GENERIC; CDS_LMAN_SYM_OUTLINE: -50,50,50,-50; FP_TECH: TK2; IP: GENERIC; ROOM: NONE; OriginalSymbolOrigin: (-25,75); XY: (-350,4025); VER: 2; ROT: 0; PHYS_PAGE: 16; LOCATION: R4B51; DRAWING: @RVP1_ADL_SB_ADP_S_DDR5_SODIMM_2DPC_LIB.H55_DG2_2DPC(SCH_1):PAGE16; CDS_LIB: c_discrete; VARIANT: ?; PCB Footprint: CTK2_SM0201_630X330_MA; CHIPS_PART_NAME: C_RES; CDS_PART_NAME: C_RES_0201-C80792-012,EMPTY,1K,5%,0.05W,TK2,GENERIC; CDS_LOCATION: R4B51
R4B59 = C_RES: CDS_PHYS_PART_NAME: C_RES_0201-C80792-002,RES,10K,5%,0.05W,TK2,GENERIC; CDS_LMAN_SYM_OUTLINE: -50,50,50,-50; FP_TECH: TK2; IP: GENERIC; ROOM: NONE; OriginalSymbolOrigin: (-25,75); XY: (-1475,1575); VER: 2; ROT: 0; PHYS_PAGE: 16; LOCATION: R4B59; DRAWING: @RVP1_ADL_SB_ADP_S_DDR5_SODIMM_2DPC_LIB.H55_DG2_2DPC(SCH_1):PAGE16; CDS_LIB: c_discrete; VARIANT: ?; PCB Footprint: CTK2_SM0201_630X330_MA; CHIPS_PART_NAME: C_RES; CDS_PART_NAME: C_RES_0201-C80792-002,RES,10K,5%,0.05W,TK2,GENERIC; CDS_LOCATION: R4B59
R4B61 = C_RES: CDS_PHYS_PART_NAME: C_RES_0201-C80792-012,EMPTY,1K,5%,0.05W,TK2,GENERIC; CDS_LMAN_SYM_OUTLINE: -50,50,50,-50; FP_TECH: TK2; IP: GENERIC; ROOM: NONE; OriginalSymbolOrigin: (-25,75); XY: (-750,4025); VER: 2; ROT: 0; PHYS_PAGE: 16; LOCATION: R4B61; DRAWING: @RVP1_ADL_SB_ADP_S_DDR5_SODIMM_2DPC_LIB.H55_DG2_2DPC(SCH_1):PAGE16; CDS_LIB: c_discrete; VARIANT: ?; PCB Footprint: CTK2_SM0201_630X330_MA; CHIPS_PART_NAME: C_RES; CDS_PART_NAME: C_RES_0201-C80792-012,EMPTY,1K,5%,0.05W,TK2,GENERIC; CDS_LOCATION: R4B61
R4B63 = C_RES: CDS_PHYS_PART_NAME: C_RES_0201-C80792-002,RES,10K,5%,0.05W,TK2,GENERIC; CDS_LMAN_SYM_OUTLINE: -50,50,50,-50; FP_TECH: TK2; IP: GENERIC; ROOM: NONE; OriginalSymbolOrigin: (-25,75); XY: (-1500,1050); VER: 2; ROT: 0; PHYS_PAGE: 16; LOCATION: R4B63; DRAWING: @RVP1_ADL_SB_ADP_S_DDR5_SODIMM_2DPC_LIB.H55_DG2_2DPC(SCH_1):PAGE16; CDS_LIB: c_discrete; VARIANT: ?; PCB Footprint: CTK2_SM0201_630X330_MA; CHIPS_PART_NAME: C_RES; CDS_PART_NAME: C_RES_0201-C80792-002,RES,10K,5%,0.05W,TK2,GENERIC; CDS_LOCATION: R4B63
R4M49 = RES#1: PART_NUMBER: A93549-016; CHIPS_PART_NAME: RES; CDS_PHYS_PART_NAME: RES_0402-A93549-016,CHIP,1K,5%,1/16W,LPDB,GENERIC; WATTAGE: 1/16W; OriginalSymbolOrigin: (-75,25); XY: (-5300,2525); VER: 1; ROT: 3; PHYS_PAGE: 16; LOCATION: R4M49; DRAWING: @RVP1_ADL_SB_ADP_S_DDR5_SODIMM_2DPC_LIB.H55_DG2_2DPC(SCH_1):PAGE16; CDS_LIB: discrete; PCB Footprint: SMR0402IA; CDS_PART_NAME: RES_0402-A93549-016,CHIP,1K,5%,1/16W,LPDB,GENERIC; CDS_LOCATION: R4M49; ASI_MODEL: A93549-016
R401 = RES_2: CDS_PHYS_PART_NAME: RES_2_0402-A93549-016,RES,1K,5%,1/16W,TK0,GENERIC; CDS_LMAN_SYM_OUTLINE: -50,50,50,-50; FP_TECH: TK0; IP: GENERIC; ROOM: NONE; OriginalSymbolOrigin: (-25,75); XY: (-4725,2425); VER: 2; ROT: 0; PHYS_PAGE: 16; LOCATION: R401; DRAWING: @RVP1_ADL_SB_ADP_S_DDR5_SODIMM_2DPC_LIB.H55_DG2_2DPC(SCH_1):PAGE16; CDS_LIB: discrete_2; VARIANT: ?; PCB Footprint: TK0_SM0402_1100X550_MC; CHIPS_PART_NAME: RES_2; CDS_PART_NAME: RES_2_0402-A93549-016,RES,1K,5%,1/16W,TK0,GENERIC; CDS_LOCATION: R401
R734 = RES: CDS_PHYS_PART_NAME: RES_0201-H74132-007,EMPTY,1K,1%,1/20W,LPDB,GENERIC; OriginalSymbolOrigin: (-25,75); XY: (-5300,2225); VER: 2; ROT: 0; PHYS_PAGE: 16; LOCATION: R734; FP_TECH: LPDB; DRAWING: @RVP1_ADL_SB_ADP_S_DDR5_SODIMM_2DPC_LIB.H55_DG2_2DPC(SCH_1):PAGE16; CDS_LIB: discrete; PCB Footprint: SMR0201IA; SEC_TYPE: 0201; CHIPS_PART_NAME: RES; CDS_PART_NAME: RES_0201-H74132-007,EMPTY,1K,1%,1/20W,LPDB,GENERIC; CDS_LOCATION: R734
R1601 = RES#1: CHIPS_PART_NAME: RES; CDS_PHYS_PART_NAME: RES_0402-A93548-094,CHIP,499,1%,1/16W,LPDB,GENERIC; WATTAGE: 1/16W; OriginalSymbolOrigin: (-75,25); XY: (-7000,1600); VER: 1; ROT: 0; PHYS_PAGE: 16; LOCATION: R1601; IP: GENERIC; FP_TECH: LPDB; FIN: CPU; DRAWING: @RVP1_ADL_SB_ADP_S_DDR5_SODIMM_2DPC_LIB.H55_DG2_2DPC(SCH_1):PAGE16; CDS_LIB: discrete; PCB Footprint: SMR0402IA; SEC_TYPE: 0402; CDS_PART_NAME: RES_0402-A93548-094,CHIP,499,1%,1/16W,LPDB,GENERIC; CDS_LOCATION: R1601; ASI_MODEL: A93548-094
R1602 = RES#1: CHIPS_PART_NAME: RES; CDS_PHYS_PART_NAME: RES_0402-A93549-030,CHIP,20,5%,1/16W,LPDB,GENERIC; WATTAGE: 1/16W; OriginalSymbolOrigin: (-75,25); XY: (-7000,900); VER: 1; ROT: 0; PHYS_PAGE: 16; LOCATION: R1602; IP: GENERIC; FP_TECH: LPDB; DRAWING: @RVP1_ADL_SB_ADP_S_DDR5_SODIMM_2DPC_LIB.H55_DG2_2DPC(SCH_1):PAGE16; CDS_LIB: discrete; PCB Footprint: SMR0402IA; SEC_TYPE: 0402; CDS_PART_NAME: RES_0402-A93549-030,CHIP,20,5%,1/16W,LPDB,GENERIC; CDS_LOCATION: R1602; ASI_MODEL: A93549-030
R1603 = RES#1: CHIPS_PART_NAME: RES; CDS_PHYS_PART_NAME: RES_0402-A93549-016,CHIP,1K,5%,1/16W,LPDB,GENERIC; WATTAGE: 1/16W; OriginalSymbolOrigin: (-75,25); XY: (-7250,3500); VER: 1; PHYS_PAGE: 16; LOCATION: R1603; IP: GENERIC; FP_TECH: LPDB; FIN: CPU; DRAWING: @RVP1_ADL_SB_ADP_S_DDR5_SODIMM_2DPC_LIB.H55_DG2_2DPC(SCH_1):PAGE16; CDS_LIB: discrete; PCB Footprint: SMR0402IA; ROT: 1; CDS_PART_NAME: RES_0402-A93549-016,CHIP,1K,5%,1/16W,LPDB,GENERIC; CDS_LOCATION: R1603; ASI_MODEL: A93549-016
R1604 = RES: CDS_PHYS_PART_NAME: RES_0402-A36093-016,EMPTY,1K,5%,1/16W,LPDB,GENERIC; WATTAGE: 1/16W; OriginalSymbolOrigin: (-25,75); XY: (-6650,625); VER: 2; ROT: 0; PHYS_PAGE: 16; LOCATION: R1604; IP: GENERIC; FP_TECH: LPDB; FIN: DEBUG; DRAWING: @RVP1_ADL_SB_ADP_S_DDR5_SODIMM_2DPC_LIB.H55_DG2_2DPC(SCH_1):PAGE16; CDS_LIB: discrete; PCB Footprint: SMR0402IA; CHIPS_PART_NAME: RES; CDS_PART_NAME: RES_0402-A36093-016,EMPTY,1K,5%,1/16W,LPDB,GENERIC; CDS_LOCATION: R1604; ASI_MODEL: A36093-016
R1605 = RES: CDS_PHYS_PART_NAME: RES_0402-A93548-023,CHIP,1K,1%,1/16W,LPDB,GENERIC; WATTAGE: 1/16W; OriginalSymbolOrigin: (-25,75); XY: (-6600,1850); VER: 2; PHYS_PAGE: 16; LOCATION: R1605; IP: GENERIC; FP_TECH: LPDB; FIN: CPU; DRAWING: @RVP1_ADL_SB_ADP_S_DDR5_SODIMM_2DPC_LIB.H55_DG2_2DPC(SCH_1):PAGE16; CDS_LIB: discrete; PCB Footprint: SMR0402IA; ROT: 2; CHIPS_PART_NAME: RES; CDS_PART_NAME: RES_0402-A93548-023,CHIP,1K,1%,1/16W,LPDB,GENERIC; CDS_LOCATION: R1605; ASI_MODEL: A93548-023
R1606 = RES#1: CHIPS_PART_NAME: RES; CDS_PHYS_PART_NAME: RES_0402-A93549-001,CHIP,0,5%,1/16W,LPDB,GENERIC; WATTAGE: 1/16W; OriginalSymbolOrigin: (-75,25); XY: (-6350,3100); VER: 1; ROT: 2; PHYS_PAGE: 16; LOCATION: R1606; IP: GENERIC; FP_TECH: LPDB; FIN: CPU; DRAWING: @RVP1_ADL_SB_ADP_S_DDR5_SODIMM_2DPC_LIB.H55_DG2_2DPC(SCH_1):PAGE16; CDS_LIB: discrete; PCB Footprint: SMR0402IA; CDS_PART_NAME: RES_0402-A93549-001,CHIP,0,5%,1/16W,LPDB,GENERIC; CDS_LOCATION: R1606; ASI_MODEL: A93549-001
R1607 = RES#1: PART_NUMBER: A93549-001; CHIPS_PART_NAME: RES; CDS_PHYS_PART_NAME: RES_0402-A93549-001,EMPTY,0,5%,1/16W,LPDB,GENERIC; WATTAGE: 1/16W; OriginalSymbolOrigin: (-75,25); XY: (-6225,1425); VER: 1; PHYS_PAGE: 16; LOCATION: R1607; IP: GENERIC; FP_TECH: LPDB; DRAWING: @RVP1_ADL_SB_ADP_S_DDR5_SODIMM_2DPC_LIB.H55_DG2_2DPC(SCH_1):PAGE16; CDS_LIB: discrete; PCB Footprint: SMR0402IA; ROT: 0; CDS_PART_NAME: RES_0402-A93549-001,EMPTY,0,5%,1/16W,LPDB,GENERIC; CDS_LOCATION: R1607
R1608 = RES: CDS_PHYS_PART_NAME: RES_0402-A93548-023,CHIP,1K,1%,1/16W,LPDB,GENERIC; WATTAGE: 1/16W; OriginalSymbolOrigin: (-25,75); XY: (-3800,1400); VER: 2; PHYS_PAGE: 16; LOCATION: R1608; IP: GENERIC; FP_TECH: LPDB; FIN: DEBUG; DRAWING: @RVP1_ADL_SB_ADP_S_DDR5_SODIMM_2DPC_LIB.H55_DG2_2DPC(SCH_1):PAGE16; CDS_LIB: discrete; PCB Footprint: SMR0402IA; ROT: 2; CHIPS_PART_NAME: RES; CDS_PART_NAME: RES_0402-A93548-023,CHIP,1K,1%,1/16W,LPDB,GENERIC; CDS_LOCATION: R1608; ASI_MODEL: A93548-023
R1609 = RES#1: CHIPS_PART_NAME: RES; CDS_PHYS_PART_NAME: RES_0402-A93549-077,CHIP,62,5%,1/16W,LPDB,GENERIC; WATTAGE: 1/16W; OriginalSymbolOrigin: (-75,25); XY: (-3500,1150); VER: 1; ROT: 0; PHYS_PAGE: 16; LOCATION: R1609; IP: GENERIC; FP_TECH: LPDB; DRAWING: @RVP1_ADL_SB_ADP_S_DDR5_SODIMM_2DPC_LIB.H55_DG2_2DPC(SCH_1):PAGE16; CDS_LIB: discrete; PCB Footprint: SMR0402IA; CDS_PART_NAME: RES_0402-A93549-077,CHIP,62,5%,1/16W,LPDB,GENERIC; CDS_LOCATION: R1609; ASI_MODEL: A93549-077
R1610 = RES#1: CHIPS_PART_NAME: RES; CDS_PHYS_PART_NAME: RES_0402-A93549-023,CHIP,10K,5%,1/16W,LPDB,GENERIC; WATTAGE: 1/16W; OriginalSymbolOrigin: (-75,25); XY: (-2000,2400); VER: 1; ROT: 0; PHYS_PAGE: 16; LOCATION: R1610; IP: GENERIC; FP_TECH: LPDB; FIN: EC; DRAWING: @RVP1_ADL_SB_ADP_S_DDR5_SODIMM_2DPC_LIB.H55_DG2_2DPC(SCH_1):PAGE16; CDS_LIB: discrete; PCB Footprint: SMR0402IA; CDS_PART_NAME: RES_0402-A93549-023,CHIP,10K,5%,1/16W,LPDB,GENERIC; CDS_LOCATION: R1610; ASI_MODEL: A93549-023
R1611 = C_RES: PART_NUMBER: A93549-027; CDS_PHYS_PART_NAME: C_RES_0402-A93549-027,RES,100K,5%,0.0625W,TK2,GENERIC; CDS_LMAN_SYM_OUTLINE: -50,50,50,-50; FP_TECH: TK2; IP: GENERIC; ROOM: NONE; WATTAGE: 0.0625W; OriginalSymbolOrigin: (-25,75); XY: (-5050,1450); VER: 2; ROT: 0; PHYS_PAGE: 16; LOCATION: R1611; DRAWING: @RVP1_ADL_SB_ADP_S_DDR5_SODIMM_2DPC_LIB.H55_DG2_2DPC(SCH_1):PAGE16; CDS_LIB: c_discrete; VARIANT: ?; PCB Footprint: CTK2_SM0402_1100X550_MA; CHIPS_PART_NAME: C_RES; CDS_PART_NAME: C_RES_0402-A93549-027,RES,100K,5%,0.0625W,TK2,GENERIC; CDS_LOCATION: R1611
U1401 = C_RPL_HX_EXT: CDS_PHYS_PART_NAME: C_RPL_HX_EXT_BGA-NA_81935,IC,RPL_HX_EXT,0.8,LPDB,GENERIC; CDS_LMAN_SYM_OUTLINE: -350,1400,350,-1350; FP_TECH: LPDB; IP: GENERIC; PACK_TYPE: BGA; ROOM: NONE; OriginalSymbolOrigin: (-375,1400); CaptureCellPackProp: C_RPL_HX_EXTE; XY: (-3250,3550); VER: 5; ROT: 0; PHYS_PAGE: 16; LOCATION: U1401; DRAWING: @RVP1_ADL_SB_ADP_S_DDR5_SODIMM_2DPC_LIB.H55_DG2_2DPC(SCH_1):PAGE16; CDS_LIB: local; VARIANT: ?; PCB Footprint: CLPDB_BGA1964_RPL_HX_LP7530_MA; SEC_TYPE: BGA; CHIPS_PART_NAME: C_RPL_HX_EXT; CDS_PART_NAME: C_RPL_HX_EXT_BGA-NA_81935,IC,RPL_HX_EXT,0.8,LPDB,GENERIC; CDS_LOCATION: U1401